# Altium schematic sheet ESP-01S-WS-V1.0.SchDoc
size A4
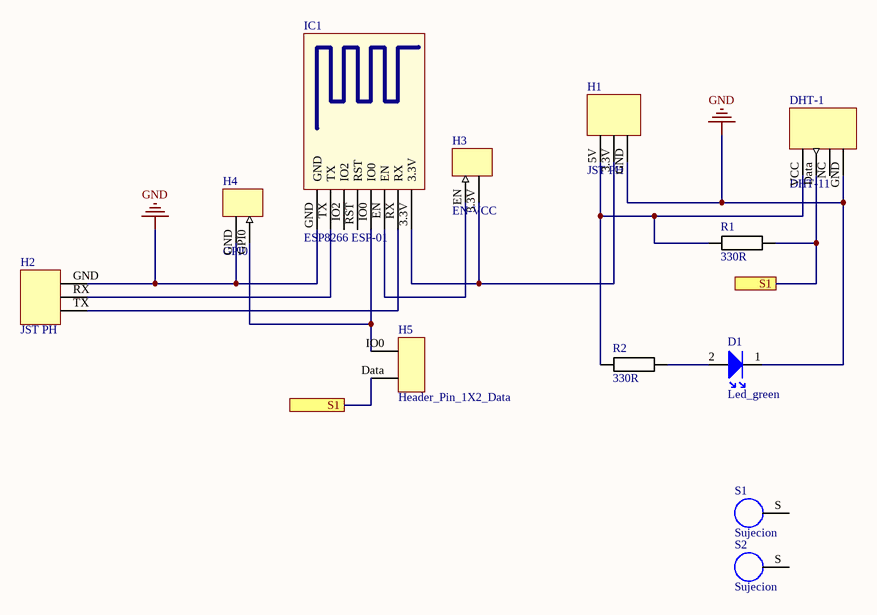
[diagram p0: ESP-01S-WS-V1.0.SchDoc]

## Parts
D1  Led_green  [Diode_5mm_green]
DHT-1  DHT-11  [DHT-11]
H1  JST PH  [JST-PH-VCC]
H2  JST PH  [HEADER_PIN_1X3_SERIAL]
H3  EN-VCC  [Header_Pin_1X2-EN]
H4  GPI0  [Header_Pin_1X2-GPI0]
H5  Header_Pin_1X2_Data  [Header_Pin_1X2_Data]
IC1  ESP8266 ESP-01  [ESP8266 ESP-01]
R1  330R  [330R_P8mm_0.25W]
R2  330R  [330R_P8mm_0.25W]
S1  Sujecion  [SUJECION]
S2  Sujecion  [SUJECION]

## Ports
S1

## Nets
GND: D1.1 DHT-1.GND H1.GND H2.GND H4.GND IC1.GND
S1: DHT-1.Data H5.Data R1.2 ; port S1
NetD1_2: D1.2 R2.2
NetDHT-1_VCC: DHT-1.VCC H1.5V R1.1 R2.1
NetH1_3.3V: H1.3.3V H3.3.3V IC1.3.3V
NetH2_RX: H2.RX IC1.TX
NetH2_TX: H2.TX IC1.RX
NetH3_EN: H3.EN IC1.EN
NetH4_GPI0: H4.GPI0 H5.IO0 IC1.IO0

Not connected (* = marked no-connect by the designer): DHT-1 NC; IC1 IO2 RST; S1 S; S2 S

## Library data of the parts
H1 = Header_Pin_1X3_VCC
H2 = Header_Pin_1X3_SERIAL
H3 = Header_Pin_1X2_EN
H4 = Header_Pin_1X2_GPI0
R1 R2 = 330R_0.25W